# EAGLE design rs232adapter (EAGLE 5.10)
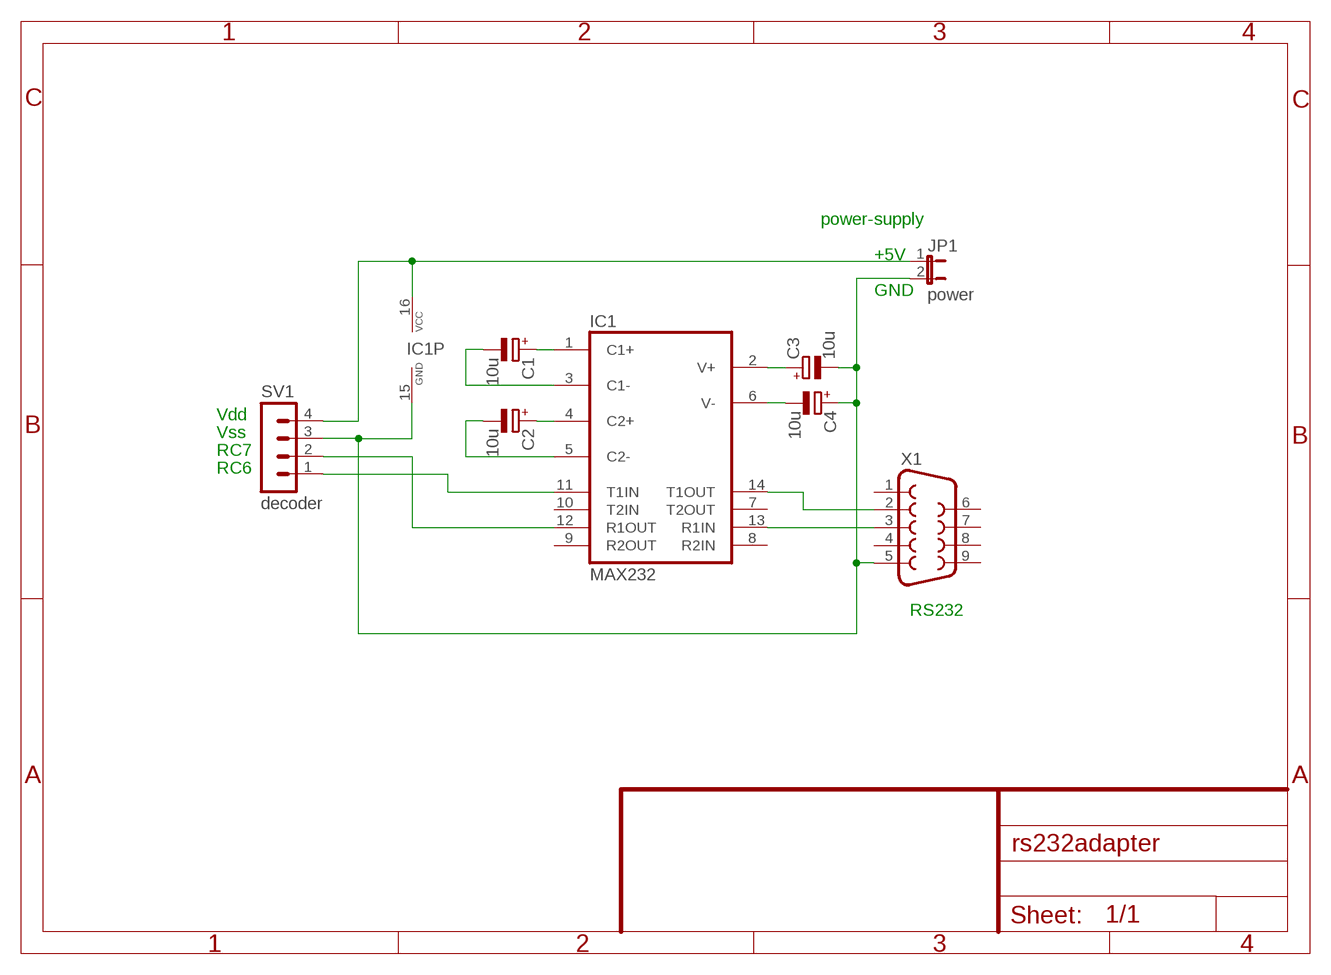
[diagram p0: schematic, sheet 1]

## Parts
C1  10u  CPOL-EUE5-4  [E5-4]
C2  10u  CPOL-EUE5-4  [E5-4]
C3  10u  CPOL-EUE5-4  [E5-4]
C4  10u  CPOL-EUE5-4  [E5-4]
IC1  MAX232  [DIL16]
JP1  power  JP1E  [JP1]
SV1  decoder  MA04-1  [MA04-1]
X1  F09H  [F09H]

## Nets
GND: C3.- C4.+ IC1.15(GND) JP1.2 SV1.3 X1.5
N$1: IC1.11(T1IN) SV1.1
N$2: IC1.12(R1OUT) SV1.2
N$3: IC1.14(T1OUT) X1.2
N$4: IC1.13(R1IN) X1.3
N$6: IC1.16(VCC) JP1.1 SV1.4
N$7: C3.+ IC1.2(V+)
N$8: C4.- IC1.6(V-)
N$9: C1.+ IC1.1(C1+)
N$10: C2.+ IC1.4(C2+)
N$11: C1.- IC1.3(C1-)
N$12: C2.- IC1.5(C2-)
Unconnected: IC1.7(T2OUT) IC1.8(R2IN) IC1.9(R2OUT) IC1.10(T2IN) X1.1 X1.4 X1.6 X1.7 X1.8 X1.9

## Notes on the sheet
- power-supply
- +5V
- GND
- Vdd
- Vss
- RC7
- RC6
- RS232

## Library data of the parts
C1-C4 = rcl:CPOL-EU: POLARIZED CAPACITOR, European symbol
IC1 = maxim:MAX232: RS232 TRANSEIVER
JP1 = jumper:JP1E: JUMPER
SV1 = con-lstb:MA04-1: PIN HEADER
X1 = con-subd:F09: SUB-D

## Board
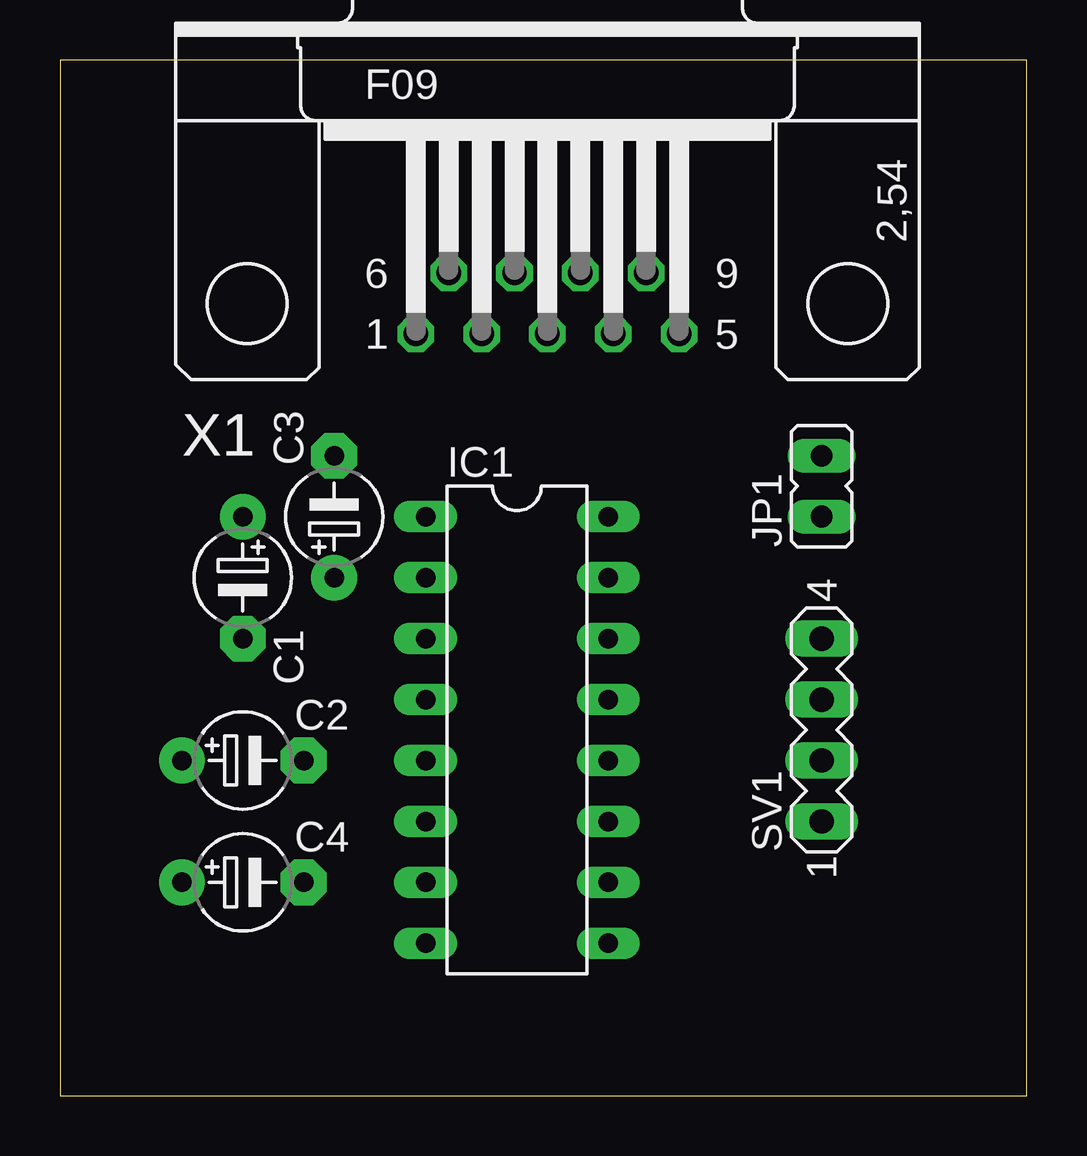
[diagram p1: board, top side]
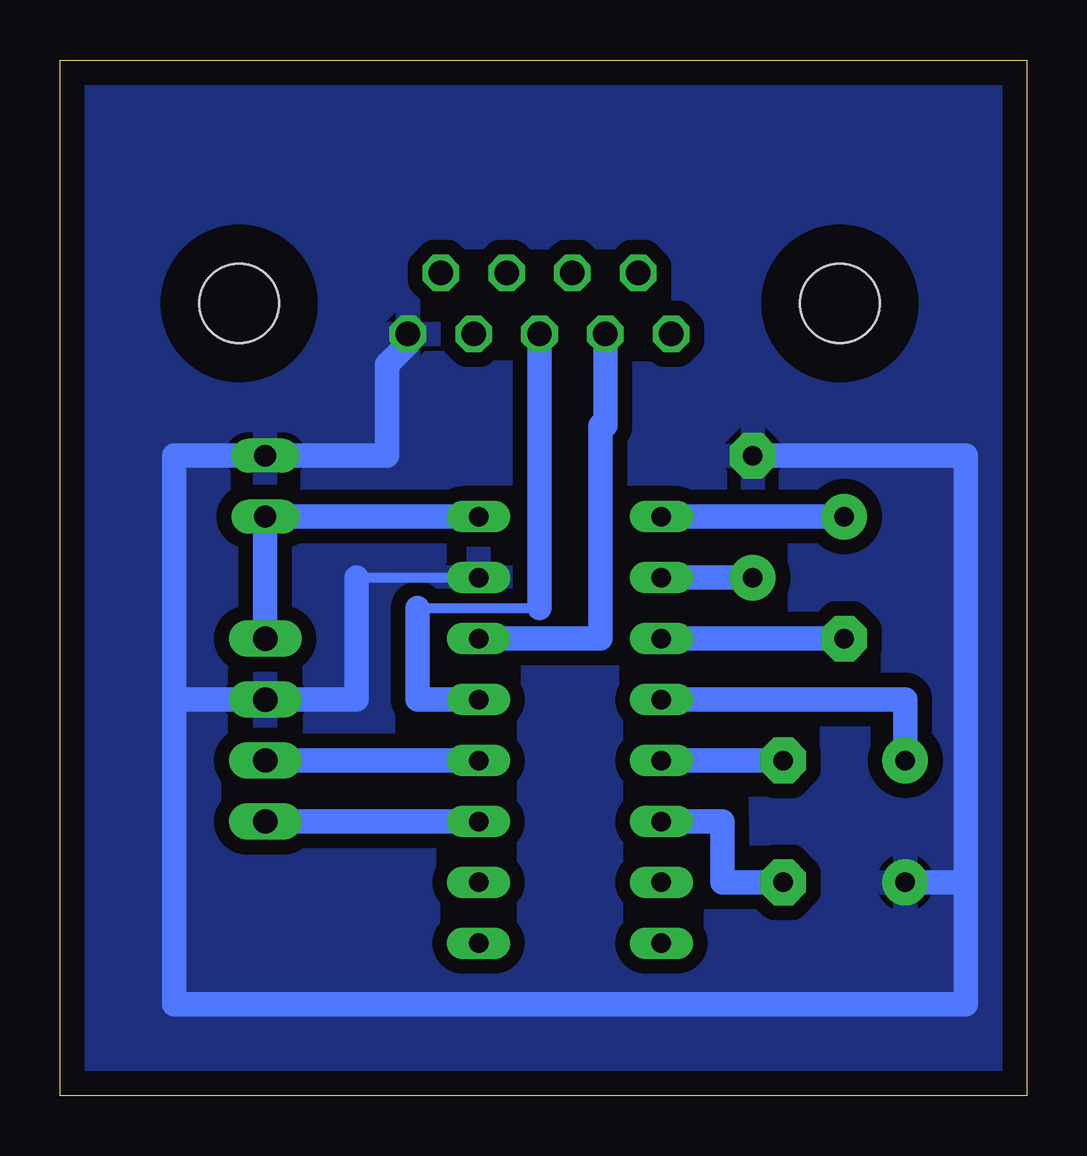
[diagram p2: board, bottom side, seen from below]

Size 40.31 x 43.17 mm. Coordinates in mm from the lower left corner, seen from the top.
Outline: 0,0 40.31,0 40.31,43.17 0,43.17 0,0
Copper layers (1*16): Top 0.035mm / dielectric 1.5mm / Bottom 0.035mm
Design rules "default": minimum track width 10mil, minimum drill 24mil, track to track 8mil, track to pad 8mil, pad to pad 8mil, via to via 8mil, smd to smd 8mil, copper to edge 40mil, drill to drill 8mil, minimum pad ring 10mil, minimum via ring 8mil, stop-mask expansion 4mil, vias tented up to drill 0mil, thermal gap 10mil

### Footprints (pad centres in the part's own frame; a part is rotated, then mirrored left to right if it is on the bottom)
E5-4 = drill 0.813 pad 1.905 round: + -2.54,0 | drill 0.813 pad 1.905 octagon: - 2.54,0
DIL16 = drill 0.813 long: 1 -8.89,-3.81; 2 -6.35,-3.81; 3 -3.81,-3.81; 4 -1.27,-3.81; 5 1.27,-3.81; 6 3.81,-3.81; 7 6.35,-3.81; 8 8.89,-3.81; 9 8.89,3.81; 10 6.35,3.81; 11 3.81,3.81; 12 1.27,3.81; 13 -1.27,3.81; 14 -3.81,3.81; 15 -6.35,3.81; 16 -8.89,3.81
JP1 = drill 0.914 long: 1 0,-1.27; 2 0,1.27
MA04-1 = drill 1.016 long: 1 -3.81,0; 2 -1.27,0; 3 1.27,0; 4 3.81,0
F09H = drill 1.016 octagon: 1 -5.486,-1.27; 2 -2.743,-1.27; 3 0,-1.27; 4 2.743,-1.27; 5 5.486,-1.27; 6 -4.115,1.27; 7 -1.372,1.27; 8 1.372,1.27; 9 4.115,1.27 | hole 3.302: -12.522,0; 12.522,0

### Placement (x,y rotation side)
C1  7.62,21.59 270 top
C2  7.62,13.97 0 top
C3  11.43,24.13 90 top
C4  7.62,8.89 0 top
IC1  19.05,15.24 270 top
JP1  31.75,25.4 0 top
SV1  31.75,15.24 90 top
X1  20.32,33.02 0 top

### Tracks (layer width: path | path; a pad name or v marks a point on that pad's centre or on a via)
GND
  Bottom 0.406: 27.94,21.59 IC1.15
  Bottom 1.016: 27.94,21.59 27.94,16.51 SV1.3 35.56,16.51 | C3.- 2.54,26.67 2.54,8.89 | 2.54,8.89 C4.+ | X1.5 25.81,31.34 26.67,30.48 26.67,26.67 JP1.2 35.56,26.67 35.56,16.51 | 35.56,16.51 35.56,3.81 2.54,3.81 2.54,8.89
  pour Bottom (isolate 0.61): 0,44.45 41.91,44.45 41.91,-1.27 -1.27,-1.27 -1.27,44.45
N$1
  Bottom 1.016: IC1.11 SV1.1
N$2
  Bottom 1.016: IC1.12 SV1.2
N$3
  Bottom 0.406: 17.78,27.94 17.58,27.94
  Bottom 1.016: IC1.14 17.78,19.05 17.78,27.94 | 17.58,27.94 X1.2
N$4
  Bottom 0.406: 25.4,20.32 20.32,20.32
  Bottom 1.016: IC1.13 25.4,16.51 25.4,20.32 | 20.32,20.32 X1.3
N$6
  Bottom 1.016: IC1.16 JP1.1 SV1.4
N$7
  Bottom 1.016: C3.+ IC1.2
N$8
  Bottom 1.016: IC1.6 12.7,11.43 12.7,8.89 C4.-
N$9
  Bottom 1.016: C1.+ IC1.1
N$10
  Bottom 1.016: IC1.4 5.08,16.51 C2.+
N$11
  Bottom 1.016: C1.- IC1.3
N$12
  Bottom 1.016: C2.- IC1.5